# EAGLE design offroad-cpu-hardware (EAGLE 7.2.0)
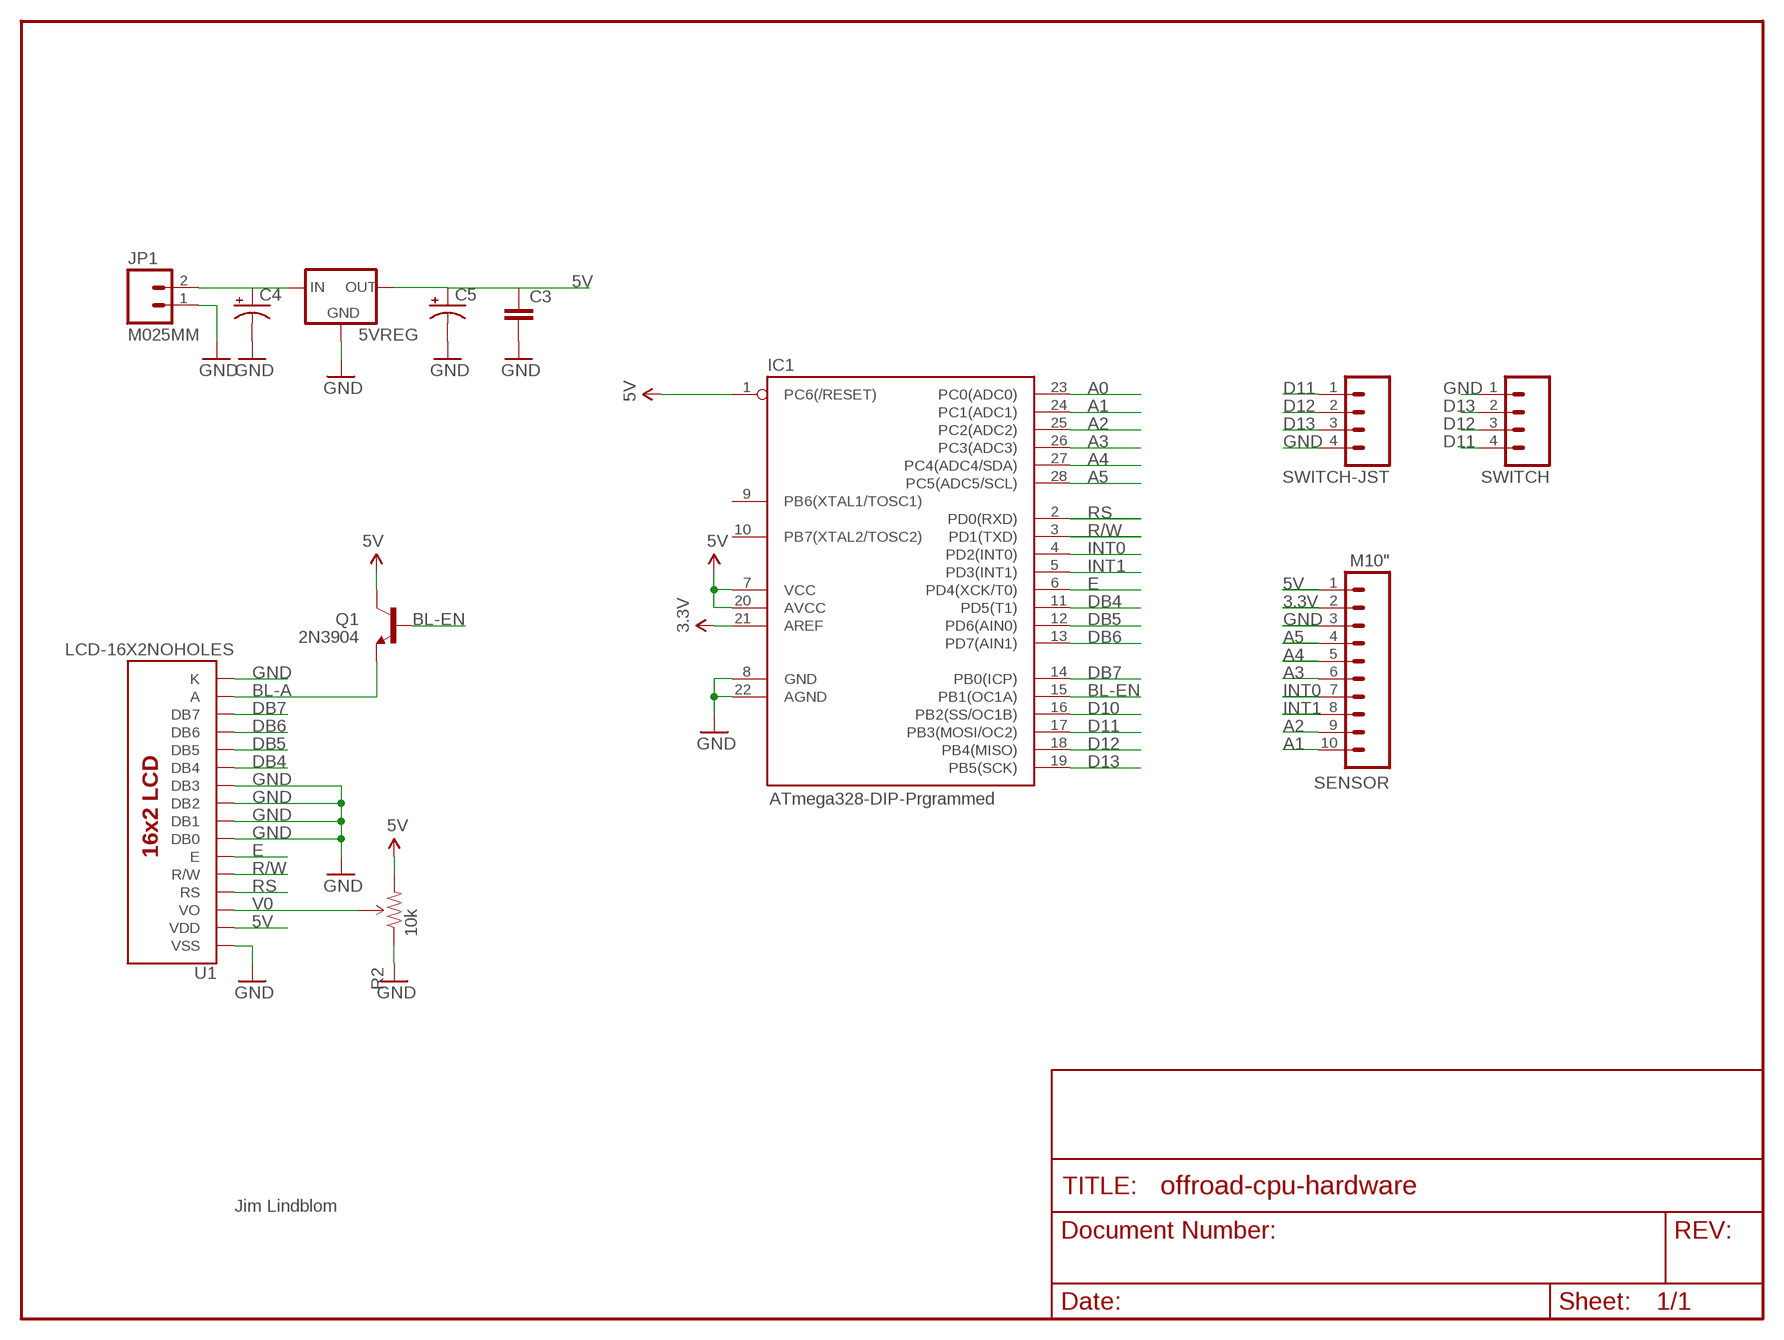
[diagram p0: schematic, sheet 1]

## Parts
5VREG  78XXS  [78XXS]
C3  CAPPTH2  [CAP-PTH-SMALL2]
C4  CAP_POLPTH2  [CPOL-RADIAL-10UF-25V]
C5  CAP_POLPTH2  [CPOL-RADIAL-10UF-25V]
IC1  ATmega328-DIP-Prgrammed  AVR-MEGA8-PPTH  [DIL28-3]
JP1  M025MM  [SCREWTERMINAL-5MM-2]
Q1  2N3904  TRANSISTOR_NPNTO92  [TO-92]
R2  10k  TRIMPOTPTH  [TRIM_POT_PTH]
SENSOR  M10"  [1X10]
SWITCH  M04PTH  [1X04]
SWITCH-JST  M04JST-PTH  [JST-4-PTH]
U1  LCD-16X2NOHOLES  [LCD-16X2_NOHOLES]

## Nets
3.3V: IC1.21(AREF) SENSOR.2
5V: 5VREG.OUT C3.1 C5.1(+) IC1.1(PC6(/RESET)) IC1.7(VCC) IC1.20(AVCC) Q1.3(C) R2.3(CW) SENSOR.1 U1.2(VDD)
A0: IC1.23(PC0(ADC0))
A1: IC1.24(PC1(ADC1)) SENSOR.10
A2: IC1.25(PC2(ADC2)) SENSOR.9
A3: IC1.26(PC3(ADC3)) SENSOR.6
A4: IC1.27(PC4(ADC4/SDA)) SENSOR.5
A5: IC1.28(PC5(ADC5/SCL)) SENSOR.4
BL-A: Q1.1(E) U1.15(A)
BL-EN: IC1.15(PB1(OC1A)) Q1.2(B)
D10: IC1.16(PB2(SS/OC1B))
D11: IC1.17(PB3(MOSI/OC2)) SWITCH-JST.1 SWITCH.4
D12: IC1.18(PB4(MISO)) SWITCH-JST.2 SWITCH.3
D13: IC1.19(PB5(SCK)) SWITCH-JST.3 SWITCH.2
DB4: IC1.11(PD5(T1)) U1.11(DB4)
DB5: IC1.12(PD6(AIN0)) U1.12(DB5)
DB6: IC1.13(PD7(AIN1)) U1.13(DB6)
DB7: IC1.14(PB0(ICP)) U1.14(DB7)
E: IC1.6(PD4(XCK/T0)) U1.6(E)
GND: 5VREG.GND C3.2 C4.2(-) C5.2(-) IC1.8(GND) IC1.22(AGND) JP1.1 R2.1(CCW) SENSOR.3 SWITCH-JST.4 SWITCH.1 U1.1(VSS) U1.7(DB0) U1.8(DB1) U1.9(DB2) U1.10(DB3) U1.16(K)
INT0: IC1.4(PD2(INT0)) SENSOR.7
INT1: IC1.5(PD3(INT1)) SENSOR.8
R/W: IC1.3(PD1(TXD)) U1.5(R/W)
RS: IC1.2(PD0(RXD)) U1.4(RS)
V0: R2.2(WIPER) U1.3(VO)
VCC: 5VREG.IN C4.1(+) JP1.2
Unconnected: IC1.9(PB6(XTAL1/TOSC1)) IC1.10(PB7(XTAL2/TOSC2))

## Notes on the sheet
- Jim Lindblom

## Library data of the parts
5VREG = v-reg:78XXS: VOLTAGE REGULATOR
C3 = SparkFun-Capacitors:CAP: Capacitor Standard 0603 ceramic capacitor, and 0.1" leaded capacitor.
C4 C5 = SparkFun-Capacitors:CAP_POL: Capacitor Polarized These are standard SMD and PTH capacitors. Normally 10uF, 47uF, and 100uF in electrolytic and tantalum varieties. Always verify the external diameter of the through hole cap, it varies with capacity, voltage, and manufacturer. The EIA devices should be standard.
IC1 = SparkFun:AVR-MEGA8-P: MICROCONTROLLER 8 Kbytes FLASH 1 kbytes SRAM 512 bytes EEPROM USART 4-channel 10 bit ADC 2-channel 8 bit ADC
JP1 = SparkFun-Connectors:M02: Standard 2-pin 0.1" header. Use with - straight break away headers ( PRT-00116) - right angle break away headers (PRT-00553) - swiss pins (PRT-00743) - machine pins (PRT-00117) - female headers (PRT-00115) Molex polarized connector foot print use with: PRT-08233 with associated crimp pins and housings. 2.54_SCREWTERM for use with PRT-10571. 3.5mm Screw Terminal footprints for PRT-08084 5mm Screw Terminal footprints for use with PRT-08433
Q1 = SparkFun-DiscreteSemi:TRANSISTOR_NPN: Generic NPN BJT MMBT2222A - TRANS-08049 (SOT-23, 1A 40V) MPSA42 - TRANS-09116 (SOT-23, 500mA 300V) MMBT5088LT1G - TRANS-11160 (SOT-23, 50 mA 30V)
R2 = SparkFun-Electromechanical:TRIMPOT: Various small potentiometers for "set-and-forget" applications
SENSOR = SparkFun-Connectors:M10: Header 10 Standard 10-pin 0.1" header. Use with straight break away headers (SKU : PRT-00116), right angle break away headers (PRT-00553), swiss pins (PRT-00743), machine pins (PRT-00117), and female headers (PRT-00115).
SWITCH SWITCH-JST = SparkFun-Connectors:M04: Header 4 Standard 4-pin 0.1" header. Use with straight break away headers (SKU : PRT-00116), right angle break away headers (PRT-00553), swiss pins (PRT-00743), machine pins (PRT-00117), and female headers (PRT-00115). Molex polarized connector foot print use with SKU : PRT-08231 with associated crimp pins and housings. 1MM SMD Version SKU: PRT-10208
U1 = SparkFun-Displays:LCD-16X2: Standard text-only 16x2 parallel input LCD

## Board
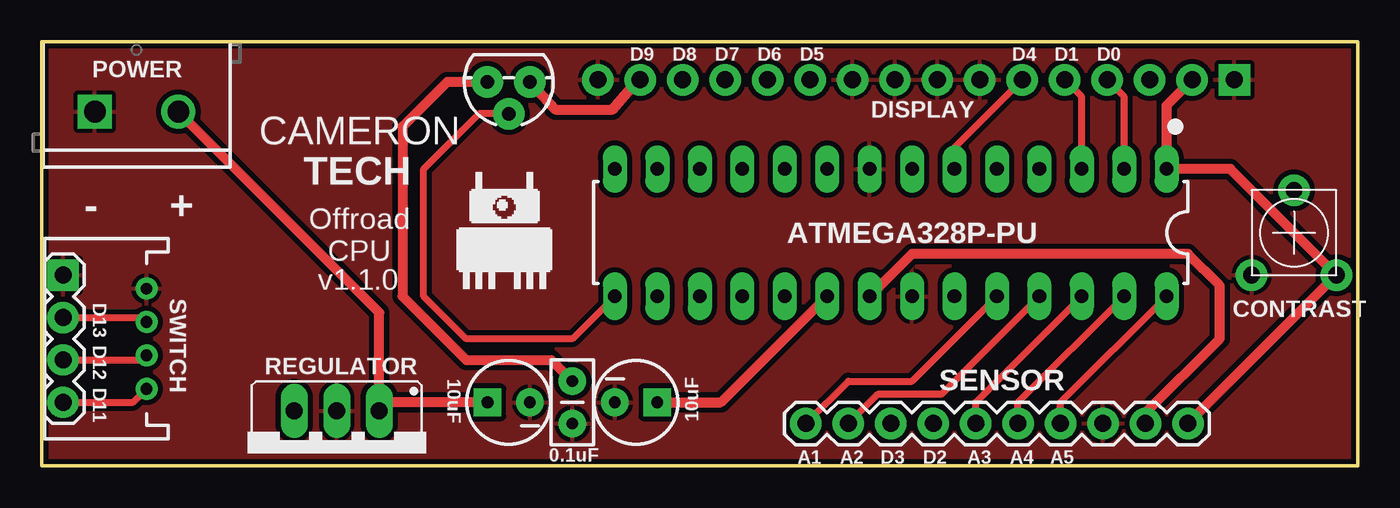
[diagram p1: board, top side]
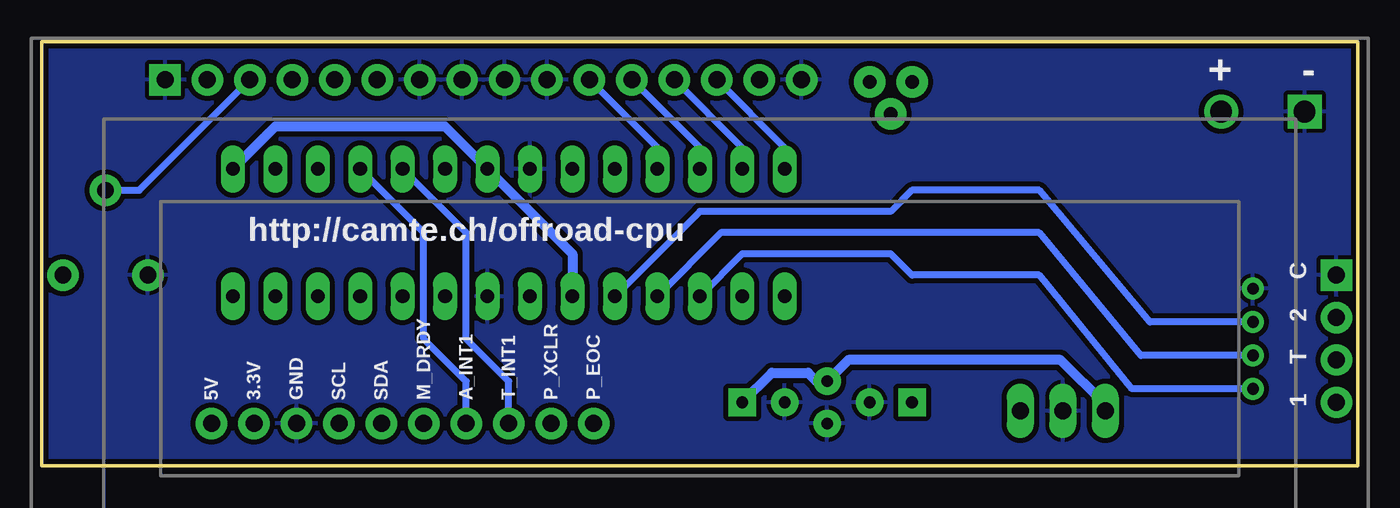
[diagram p2: board, bottom side, seen from below]

Size 78.74 x 25.4 mm. Coordinates in mm from the lower left corner, seen from the top.
Outline: 78.74,0 78.74,25.4 0,25.4 0,0 78.74,0
Copper layers (1*16): Top 0.035mm / dielectric 1.5mm / Bottom 0.035mm
Design rules "SparkFun": minimum track width 8mil, minimum drill 20mil, track to track 8mil, track to pad 8mil, pad to pad 8mil, via to via 8mil, smd to smd 8mil, copper to edge 8mil, drill to drill 8mil, minimum pad ring 12mil, minimum via ring 10mil, stop-mask expansion 4mil, vias tented up to drill 20mil, thermal gap 10mil

### Footprints (pad centres in the part's own frame; a part is rotated, then mirrored left to right if it is on the bottom)
78XXS = drill 1.016 long: GND 0,-2.54; IN -2.54,-2.54; OUT 2.54,-2.54
CAP-PTH-SMALL2 = drill 0.7 pad 1.651: 1 0,0; 2 2.54,0
CPOL-RADIAL-10UF-25V = drill 0.7 pad 1.651 square: 1 1.27,0 | drill 0.7 pad 1.651: 2 -1.27,0
DIL28-3 = drill 0.813 long: 1 -16.51,-3.81; 2 -13.97,-3.81; 3 -11.43,-3.81; 4 -8.89,-3.81; 5 -6.35,-3.81; 6 -3.81,-3.81; 7 -1.27,-3.81; 8 1.27,-3.81; 9 3.81,-3.81; 10 6.35,-3.81; 11 8.89,-3.81; 12 11.43,-3.81; 13 13.97,-3.81; 14 16.51,-3.81; 15 16.51,3.81; 16 13.97,3.81; 17 11.43,3.81; 18 8.89,3.81; 19 6.35,3.81; 20 3.81,3.81; 21 1.27,3.81; 22 -1.27,3.81; 23 -3.81,3.81; 24 -6.35,3.81; 25 -8.89,3.81; 26 -11.43,3.81; 27 -13.97,3.81; 28 -16.51,3.81
SCREWTERMINAL-5MM-2 = drill 1.3 pad 2.032 square: 1 0,0 | drill 1.3 pad 2.032: 2 5,0
TO-92 = drill 0.813 pad 1.88: 1 -1.27,0; 2 0,1.905; 3 1.27,0
TRIM_POT_PTH = drill 1 pad 1.88: 1 -2.54,-2.54; 2 0,2.54; 3 2.54,-2.54
1X10 = drill 1.016 pad 1.88: 1 0,0; 2 2.54,0; 3 5.08,0; 4 7.62,0; 5 10.16,0; 6 12.7,0; 7 15.24,0; 8 17.78,0; 9 20.32,0; 10 22.86,0
1X04 = drill 1.016 pad 1.88 square: 1 0,0 | drill 1.016 pad 1.88: 2 2.54,0; 3 5.08,0; 4 7.62,0
JST-4-PTH = drill 0.7: 1 -3,-5; 2 -1,-5; 3 1,-5; 4 3,-5
LCD-16X2_NOHOLES = drill 1.016 pad 1.88 square: 1 -32,15.5 | drill 1.016 pad 1.88: 2 -29.46,15.5; 3 -26.92,15.5; 4 -24.38,15.5; 5 -21.84,15.5; 6 -19.3,15.5; 7 -16.76,15.5; 8 -14.22,15.5; 9 -11.68,15.5; 10 -9.14,15.5; 11 -6.6,15.5; 12 -4.06,15.5; 13 -1.52,15.5; 14 1.02,15.5; 15 3.56,15.5; 16 6.1,15.5

### Placement (x,y rotation side)
5VREG  17.65,0.76 180 top
C3  31.75,5.08 270 top
C4  27.94,3.81 180 top
C5  35.56,3.81 0 top
IC1  50.8,13.97 180 top
JP1  3.17,21.21 0 top
Q1  27.94,22.99 180 top
R2  74.93,13.97 0 top
SENSOR  68.58,2.54 180 top
SWITCH  1.27,11.43 270 top
SWITCH-JST  1.27,7.62 90 top
U1  39.37,7.62 0 bottom

### Tracks (layer width: path | path; a pad name or v marks a point on that pad's centre or on a via)
3.3V
  Top 0.61: SENSOR.2 66.04,3.17 70.48,7.62 70.48,10.79 68.58,12.7 52.07,12.7 IC1.21
5V
  Top 0.61: SENSOR.1 R2.3 71.12,17.78 IC1.1 67.31,21.6 U1.2 | C3.1 30.48,6.35 25.4,6.35 21.59,10.16 21.59,20.32 24.26,22.99 Q1.3 | C5.1 40.64,3.81 IC1.20
  Bottom 0.61: IC1.20 46.99,12.7 IC1.7 54.61,20.32 64.77,20.32 IC1.1 | C5.1 35.05,5.59 32.89,5.59 32.38,5.08 C3.1 30.48,6.35 17.78,6.35 15.11,3.68 5VREG.OUT
A1
  Top 0.406: SENSOR.10 48.26,5.08 52.07,5.08 IC1.24
A2
  Top 0.406: SENSOR.9 50.04,4.32 53.85,4.32 IC1.25
A3
  Top 0.406: SENSOR.6 55.88,3.81 IC1.26
A4
  Top 0.406: SENSOR.5 58.42,3.81 IC1.27
A5
  Top 0.406: SENSOR.4 60.96,3.81 IC1.28
BL-A
  Top 0.61: Q1.1 30.73,21.34 34.16,21.34 35.81,23.25 U1.15
BL-EN
  Top 0.406: IC1.15 31.75,7.62 25.4,7.62 22.86,10.16 22.86,17.78 26.16,21.08 Q1.2
D11
  Top 0.406: SWITCH.4 5.46,3.81 SWITCH-JST.1
  Bottom 0.406: SWITCH-JST.1 13.51,4.62 19.05,11.43 26.67,11.43 27.94,12.7 36.83,12.7 IC1.17
D12
  Top 0.406: SWITCH.3 6,6.35 SWITCH-JST.2
  Bottom 0.406: SWITCH-JST.2 12.97,6.62 19.05,13.97 38.1,13.97 IC1.18
D13
  Top 0.406: SWITCH.2 6,8.89 SWITCH-JST.3
  Bottom 0.406: SWITCH-JST.3 12.43,8.62 19.05,16.51 26.67,16.51 27.94,15.24 39.37,15.24 IC1.19
DB4
  Bottom 0.406: IC1.11 41.91,19.06 U1.11
DB5
  Bottom 0.406: IC1.12 39.37,19.06 U1.12
DB6
  Bottom 0.406: IC1.13 36.83,19.06 U1.13
DB7
  Bottom 0.406: IC1.14 34.29,19.06 U1.14
E
  Top 0.406: IC1.6 54.61,19.06 U1.6
GND
  pour Bottom (isolate 0.305): 0,25.4 0,0 78.74,0 78.74,25.4
  pour Top (isolate 0.305): 0,25.4 0,0 78.74,0 78.74,25.4
INT0
  Bottom 0.406: SENSOR.7 53.34,5.08 55.88,7.62 55.88,13.97 IC1.4
INT1
  Bottom 0.406: SENSOR.8 50.8,5.08 53.34,7.62 53.34,13.97 IC1.5
R/W
  Top 0.406: IC1.3 62.23,22.1 U1.5
RS
  Top 0.406: IC1.2 64.77,22.1 U1.4
V0
  Bottom 0.406: R2.2 72.9,16.51 U1.3
VCC
  Top 0.61: C4.1 20.07,3.81 5VREG.IN 20.19,9.19 JP1.2

### Text on the board
tPlace: D9 | D8 | D7 | D6 | D5 | D4 | D1 | D0 | POWER | DISPLAY | CAMERON | TECH | - | + | ATMEGA328P-PU | Offroad / CPU | v1.1.0 | D13 | SWITCH | CONTRAST | D12 | D11 | REGULATOR | 10uF | 10uF | 0.1uF | A1 | A2 | D3 | D2 | A3 | A4 | A5
bNames: - | + | http://camte.ch/offroad-cpu | C | 2 | T | 1 | P_EOC | P_XCLR | T_INT1 | A_INT1 | M_DRDY | SDA | SCL | GND | 3.3V | 5V